# Altium schematic sheet PMIC.SchDoc
size A3; SheetNumber: 5; SheetTotal: 5
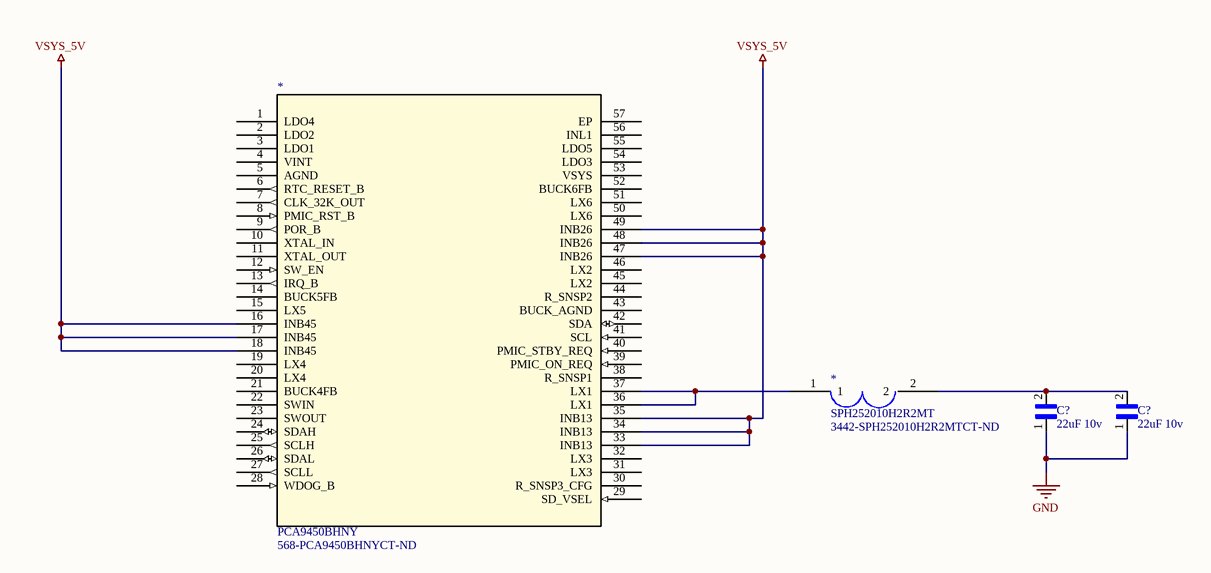
[diagram p0: PMIC.SchDoc]

## Parts
(Parts that share a designator on the sheet are numbered #1, #2 ... from top to bottom, then left to right.)
*#1  PCA9450BHNY  Supplier Part Number 1: 568-PCA9450BHNYCT-ND  [HVQFN56_SOT949-6_NXP]
*#2  SPH252010H2R2MT  Supplier Part Number 1: 3442-SPH252010H2R2MTCT-ND  [IND-SMD_L2.5-W2.0_SWPA252012S]
C?#1  22uF 10v  [CAPC1608X100N]
C?#2  22uF 10v  [CAPC1608X100N]

## Nets
GND: C?#1.1 C?#2.1
VSYS_5V: *#1.16(INB45) *#1.17(INB45) *#1.18(INB45) *#1.33(INB13) *#1.34(INB13) *#1.35(INB13) *#1.47(INB26) *#1.48(INB26) *#1.49(INB26)
Net*#1_36: *#1.36(LX1) *#1.37(LX1) *#2.1
Net*#2_2: *#2.2 C?#1.2 C?#2.2

Not connected (* = marked no-connect by the designer): *#1 1(LDO4) 2(LDO2) 3(LDO1) 4(VINT) 5(AGND) 6(RTC_RESET_B) 7(CLK_32K_OUT) 8(PMIC_RST_B) 9(POR_B) 10(XTAL_IN) 11(XTAL_OUT) 12(SW_EN) 13(IRQ_B) 14(BUCK5FB) 15(LX5) 19(LX4) 20(LX4) 21(BUCK4FB) 22(SWIN) 23(SWOUT) 24(SDAH) 25(SCLH) 26(SDAL) 27(SCLL) 28(WDOG_B) 29(SD_VSEL) 30(R_SNSP3_CFG) 31(LX3) 32(LX3) 38(R_SNSP1) 39(PMIC_ON_REQ) 40(PMIC_STBY_REQ) 41(SCL) 42(SDA) 43(BUCK_AGND) 44(R_SNSP2) 45(LX2) 46(LX2) 50(LX6) 51(LX6) 52(BUCK6FB) 53(VSYS) 54(LDO3) 55(LDO5) 56(INL1) 57(EP)

## Library data of the parts
*#1 = PCA9450BHNY: Power Manage Ic (Pmic) For I.mx 8M Nano Rohs Compliant: Yes |Nxp PCA9450BHNY; Manufacturer: NXP Semiconductors; Supplier 1: Digikey; Manufacturer Part Number: PCA9450BHNY; RoHS: No; Category: Power Management ICs; Stock 1: 7995; Pricing 1: 1=5.66, 10=4.331, 25=3.9992, 100=3.6339, 250=3.45972, 500=3.35474, 1000=3.26833 (USD); RoHS Compliant: Yes; ComponentLink1URL: https://datasheet.octopart.com/PCA9450BHNY-NXP-Semiconductors-datasheet-150009921.pdf?src-supplier=Future+Electronics; ComponentLink1Description: https://datasheet.octopart.com/PCA9450BHNY-NXP-Semiconductors-datasheet-150009921.pdf?src-supplier=Future+Electronics
*#2 = SPH252010H2R2MT: Fixed Ind 2.220%UH 0.114 Ohm 1800; Manufacturer: Sunlord; Supplier 1: Digikey; Manufacturer Part Number: SPH252010H2R2MT; RoHS: Yes; Category: Fixed Inductors; Stock 1: 1953; Pricing 1: 1=0.27, 10=0.207, 25=0.1872, 50=0.1736, 100=0.1609, 250=0.14548, 500=0.13478, 1000=0.125 (USD); RoHS Compliant: Yes
C?#1 C?#2 = GRM188R61A226ME15D: SMD Capacitor X5R(EIA) with Capacitance: 22uF Tol. 20%. Rated Voltage: 10Vdc; Value: *; Availability: Unavailable; Package: None; MP: GRM188R61A226ME15D; Price: None